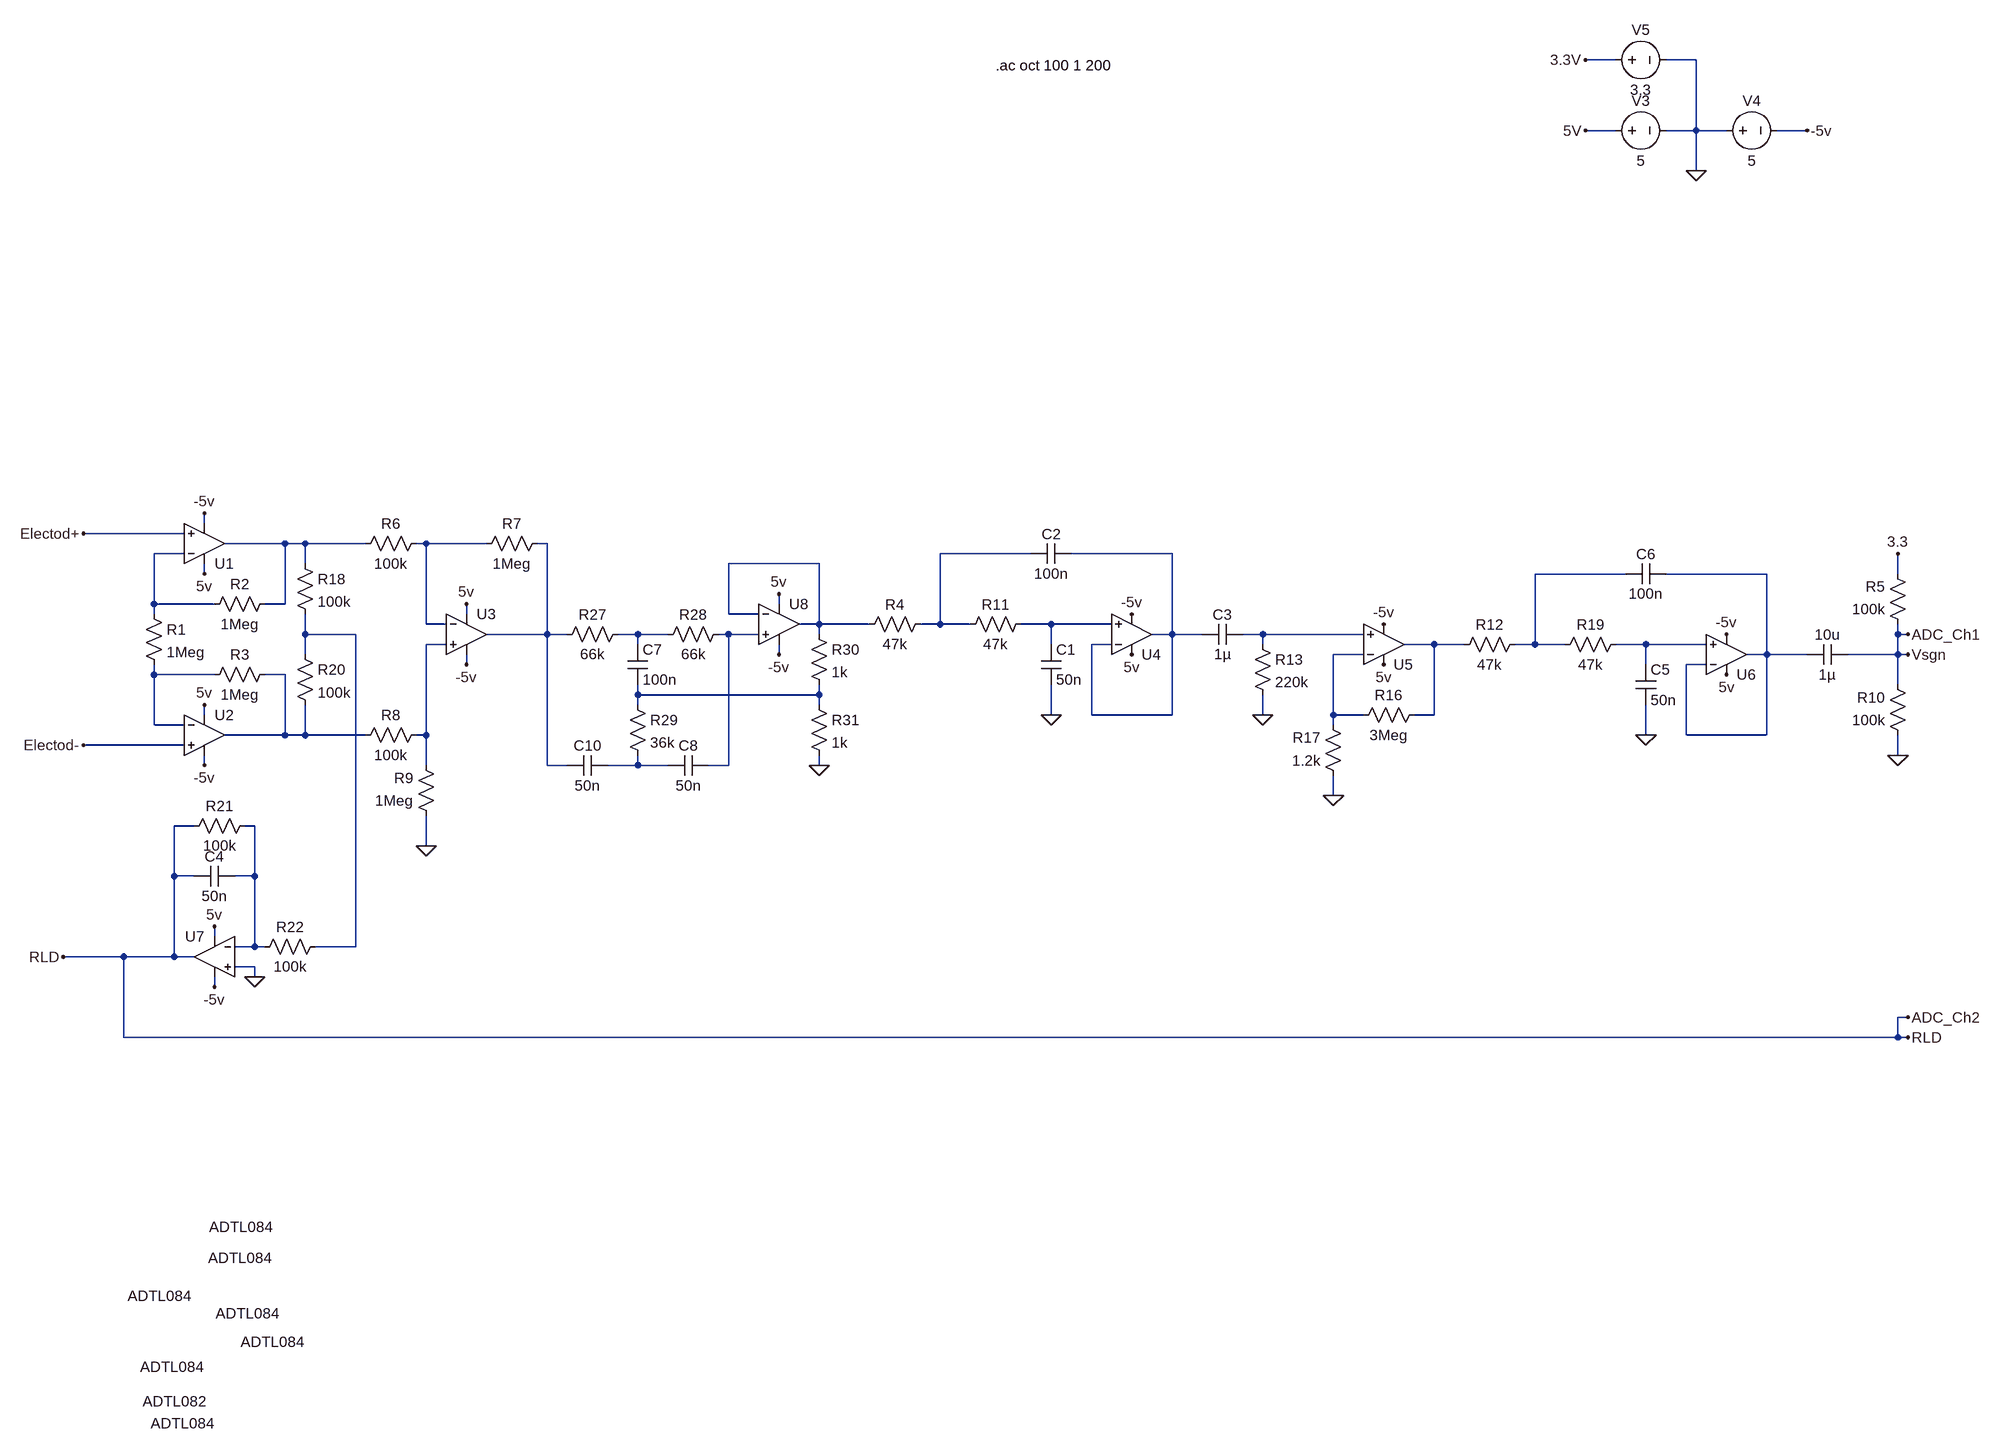
[diagram p0: schematic InstrumentationAmp.asc]
InstrumentationAmp.asc, the LTspice schematic file:
Version 4.1
SHEET 1 2556 1432
WIRE 1952 -752 1904 -752
WIRE 2080 -752 2032 -752
WIRE 1952 -640 1904 -640
WIRE 2080 -640 2080 -752
WIRE 2080 -640 2032 -640
WIRE 2128 -640 2080 -640
WIRE 2256 -640 2208 -640
WIRE 2080 -576 2080 -640
WIRE -288 -16 -288 -32
WIRE -320 0 -480 0
WIRE -160 16 -256 16
WIRE -128 16 -160 16
WIRE -32 16 -128 16
WIRE 64 16 48 16
WIRE 160 16 64 16
WIRE 256 16 240 16
WIRE -320 32 -368 32
WIRE 1024 32 880 32
WIRE 1248 32 1088 32
WIRE -128 48 -128 16
WIRE 688 48 544 48
WIRE -288 64 -288 48
WIRE 1968 64 1824 64
WIRE 2192 64 2032 64
WIRE 2400 64 2400 32
WIRE -368 112 -368 32
WIRE -272 112 -368 112
WIRE -160 112 -160 16
WIRE -160 112 -192 112
WIRE 624 112 624 96
WIRE -368 128 -368 112
WIRE 128 128 128 112
WIRE 544 128 544 48
WIRE 592 128 544 128
WIRE 64 144 64 16
WIRE 96 144 64 144
WIRE 688 144 688 48
WIRE 688 144 656 144
WIRE 768 144 688 144
WIRE 880 144 880 32
WIRE 880 144 848 144
WIRE 928 144 880 144
WIRE 1056 144 1008 144
WIRE 1152 144 1056 144
WIRE -128 160 -128 128
WIRE -48 160 -128 160
WIRE 256 160 256 16
WIRE 256 160 160 160
WIRE 288 160 256 160
WIRE 400 160 368 160
WIRE 448 160 400 160
WIRE 544 160 528 160
WIRE 592 160 544 160
WIRE 688 160 688 144
WIRE 1248 160 1248 32
WIRE 1248 160 1216 160
WIRE 1296 160 1248 160
WIRE 1392 160 1360 160
WIRE 1552 160 1392 160
WIRE 2400 160 2400 144
WIRE 2416 160 2400 160
WIRE 96 176 64 176
WIRE 400 176 400 160
WIRE 1056 176 1056 144
WIRE 1152 176 1120 176
WIRE 1392 176 1392 160
WIRE 1664 176 1616 176
WIRE 1712 176 1664 176
WIRE 1824 176 1824 64
WIRE 1824 176 1792 176
WIRE 1872 176 1824 176
WIRE 2000 176 1952 176
WIRE 2096 176 2000 176
WIRE -128 192 -128 160
WIRE 624 192 624 176
WIRE 1552 192 1504 192
WIRE 2192 192 2192 64
WIRE 2192 192 2160 192
WIRE 2256 192 2192 192
WIRE 2400 192 2400 160
WIRE 2400 192 2320 192
WIRE 2416 192 2400 192
WIRE 128 208 128 192
WIRE 2000 208 2000 176
WIRE 2096 208 2064 208
WIRE -368 224 -368 208
WIRE -272 224 -368 224
WIRE -160 224 -192 224
WIRE 2400 240 2400 192
WIRE 400 256 400 240
WIRE 688 256 688 240
WIRE 688 256 400 256
WIRE 400 272 400 256
WIRE 688 272 688 256
WIRE -288 288 -288 272
WIRE 1056 288 1056 240
WIRE 1120 288 1120 176
WIRE 1248 288 1248 160
WIRE 1248 288 1120 288
WIRE 1392 288 1392 256
WIRE 1504 288 1504 192
WIRE 1552 288 1504 288
WIRE 1664 288 1664 176
WIRE 1664 288 1632 288
WIRE -368 304 -368 224
WIRE -320 304 -368 304
WIRE 1504 304 1504 288
WIRE -160 320 -160 224
WIRE -160 320 -256 320
WIRE -128 320 -128 272
WIRE -128 320 -160 320
WIRE -32 320 -128 320
WIRE 64 320 64 176
WIRE 64 320 48 320
WIRE 2000 320 2000 272
WIRE 2064 320 2064 208
WIRE 2192 320 2192 192
WIRE 2192 320 2064 320
WIRE -320 336 -480 336
WIRE 2400 352 2400 320
WIRE -288 368 -288 352
WIRE 64 368 64 320
WIRE 256 368 256 160
WIRE 288 368 256 368
WIRE 400 368 400 352
WIRE 400 368 352 368
WIRE 448 368 400 368
WIRE 544 368 544 160
WIRE 544 368 512 368
WIRE 688 368 688 352
WIRE 1504 416 1504 384
WIRE -304 464 -336 464
WIRE -208 464 -224 464
WIRE 64 496 64 448
WIRE -336 544 -336 464
WIRE -304 544 -336 544
WIRE -208 544 -208 464
WIRE -208 544 -240 544
WIRE -272 640 -272 624
WIRE -208 656 -208 544
WIRE -208 656 -240 656
WIRE -192 656 -208 656
WIRE -48 656 -48 160
WIRE -48 656 -112 656
WIRE -416 672 -512 672
WIRE -336 672 -336 544
WIRE -336 672 -416 672
WIRE -304 672 -336 672
WIRE -208 688 -240 688
WIRE -208 704 -208 688
WIRE -272 720 -272 704
WIRE 2416 768 2400 768
WIRE -416 800 -416 672
WIRE 2400 800 2400 768
WIRE 2400 800 -416 800
WIRE 2416 800 2400 800
FLAG 2080 -576 0
FLAG 1904 -640 5V
FLAG 2256 -640 -5v
FLAG -288 64 5v
FLAG -288 -32 -5v
FLAG -288 272 5v
FLAG -288 368 -5v
FLAG 128 112 5v
FLAG 128 208 -5v
FLAG 64 496 0
FLAG 2400 352 0
FLAG 2400 32 3.3
FLAG 2416 192 Vsgn
FLAG 1904 -752 3.3V
FLAG 1184 128 -5v
FLAG 1184 192 5v
FLAG 1056 288 0
FLAG 1392 288 0
FLAG 1584 208 5v
FLAG 1584 144 -5v
FLAG 1504 416 0
FLAG 2128 160 -5v
FLAG 2128 224 5v
FLAG 2000 320 0
FLAG -272 624 5v
FLAG -272 720 -5v
FLAG -208 704 0
FLAG 624 96 5v
FLAG 624 192 -5v
FLAG 688 368 0
FLAG -480 0 Electod+
FLAG -480 336 Electod-
FLAG -512 672 RLD
FLAG 2416 800 RLD
FLAG 2416 160 ADC_Ch1
FLAG 2416 768 ADC_Ch2
SYMBOL OpAmps\\ADTL084 -288 80 M180
WINDOW 3 8 -1021 Left 2
SYMATTR InstName U1
SYMBOL voltage 1936 -640 R270
WINDOW 0 32 56 VTop 2
WINDOW 3 -32 56 VBottom 2
WINDOW 123 0 0 Left 0
WINDOW 39 0 0 Left 0
SYMATTR InstName V3
SYMATTR Value 5
SYMBOL voltage 2112 -640 R270
WINDOW 0 32 56 VTop 2
WINDOW 3 -32 56 VBottom 2
WINDOW 123 0 0 Left 0
WINDOW 39 0 0 Left 0
SYMATTR InstName V4
SYMATTR Value 5
SYMBOL res -384 112 R0
SYMATTR InstName R1
SYMATTR Value 1Meg
SYMBOL res -288 128 R270
WINDOW 0 32 56 VTop 2
WINDOW 3 0 56 VBottom 2
SYMATTR InstName R2
SYMATTR Value 1Meg
SYMBOL res -288 240 R270
WINDOW 0 32 56 VTop 2
WINDOW 3 0 56 VBottom 2
SYMATTR InstName R3
SYMATTR Value 1Meg
SYMBOL OpAmps\\ADTL084 -288 256 R0
WINDOW 3 6 894 Left 2
SYMATTR InstName U2
SYMBOL OpAmps\\ADTL084 128 96 R0
WINDOW 3 -358 1187 Left 2
SYMATTR InstName U3
SYMBOL res 64 0 R90
WINDOW 0 0 56 VBottom 2
WINDOW 3 32 56 VTop 2
SYMATTR InstName R6
SYMATTR Value 100k
SYMBOL res 256 0 R90
WINDOW 0 0 56 VBottom 2
WINDOW 3 32 56 VTop 2
SYMATTR InstName R7
SYMATTR Value 1Meg
SYMBOL res 64 304 R90
WINDOW 0 0 56 VBottom 2
WINDOW 3 32 56 VTop 2
SYMATTR InstName R8
SYMATTR Value 100k
SYMBOL res 80 464 R180
WINDOW 0 36 76 Left 2
WINDOW 3 36 40 Left 2
SYMATTR InstName R9
SYMATTR Value 1Meg
SYMBOL res 2416 160 R180
WINDOW 0 36 76 Left 2
WINDOW 3 36 40 Left 2
SYMATTR InstName R5
SYMATTR Value 100k
SYMBOL res 2416 336 R180
WINDOW 0 36 76 Left 2
WINDOW 3 36 40 Left 2
SYMATTR InstName R10
SYMATTR Value 100k
SYMBOL voltage 1936 -752 R270
WINDOW 0 32 56 VTop 2
WINDOW 3 -32 56 VBottom 2
WINDOW 123 0 0 Left 0
WINDOW 39 0 0 Left 0
SYMATTR InstName V5
SYMATTR Value 3.3
SYMBOL OpAmps\\ADTL084 1184 224 M180
WINDOW 3 -1574 -1099 Left 2
SYMATTR InstName U4
SYMBOL cap 2320 176 R90
WINDOW 0 0 32 VBottom 2
WINDOW 3 32 32 VTop 2
SYMATTR InstName 10u
SYMATTR Value 1µ
SYMBOL res 864 128 R90
WINDOW 0 0 56 VBottom 2
WINDOW 3 32 56 VTop 2
SYMATTR InstName R4
SYMATTR Value 47k
SYMBOL cap 1360 144 R90
WINDOW 0 0 32 VBottom 2
WINDOW 3 32 32 VTop 2
SYMATTR InstName C3
SYMATTR Value 1µ
SYMBOL res 1376 160 R0
SYMATTR InstName R13
SYMATTR Value 220k
SYMBOL OpAmps\\ADTL082 1584 240 M180
WINDOW 3 -1970 -1138 Left 2
SYMATTR InstName U5
SYMBOL res 1648 272 R90
WINDOW 0 0 56 VBottom 2
WINDOW 3 32 56 VTop 2
SYMATTR InstName R16
SYMATTR Value 3Meg
SYMBOL res 1520 400 R180
WINDOW 0 36 76 Left 2
WINDOW 3 36 40 Left 2
SYMATTR InstName R17
SYMATTR Value 1.2k
SYMBOL res 1024 128 R90
WINDOW 0 0 56 VBottom 2
WINDOW 3 32 56 VTop 2
SYMATTR InstName R11
SYMATTR Value 47k
SYMBOL cap 1040 176 R0
SYMATTR InstName C1
SYMATTR Value 50n
SYMBOL cap 1088 16 R90
WINDOW 0 0 32 VBottom 2
WINDOW 3 32 32 VTop 2
SYMATTR InstName C2
SYMATTR Value 100n
SYMBOL OpAmps\\ADTL084 2128 256 M180
WINDOW 3 -2501 -1157 Left 2
SYMATTR InstName U6
SYMBOL res 1808 160 R90
WINDOW 0 0 56 VBottom 2
WINDOW 3 32 56 VTop 2
SYMATTR InstName R12
SYMATTR Value 47k
SYMBOL res 1968 160 R90
WINDOW 0 0 56 VBottom 2
WINDOW 3 32 56 VTop 2
SYMATTR InstName R19
SYMATTR Value 47k
SYMBOL cap 1984 208 R0
SYMATTR InstName C5
SYMATTR Value 50n
SYMBOL cap 2032 48 R90
WINDOW 0 0 32 VBottom 2
WINDOW 3 32 32 VTop 2
SYMATTR InstName C6
SYMATTR Value 100n
SYMBOL res -144 32 R0
SYMATTR InstName R18
SYMATTR Value 100k
SYMBOL res -144 176 R0
SYMATTR InstName R20
SYMATTR Value 100k
SYMBOL OpAmps\\ADTL084 -272 608 M0
WINDOW 3 -104 630 Left 2
SYMATTR InstName U7
SYMBOL res -208 448 R90
WINDOW 0 0 56 VBottom 2
WINDOW 3 32 56 VTop 2
SYMATTR InstName R21
SYMATTR Value 100k
SYMBOL res -96 640 R90
WINDOW 0 0 56 VBottom 2
WINDOW 3 32 56 VTop 2
SYMATTR InstName R22
SYMATTR Value 100k
SYMBOL cap -240 528 R90
WINDOW 0 0 32 VBottom 2
WINDOW 3 32 32 VTop 2
SYMATTR InstName C4
SYMATTR Value 50n
SYMBOL OpAmps\\ADTL084 624 80 R0
WINDOW 3 -1034 1130 Left 2
SYMATTR InstName U8
SYMBOL res 384 144 R90
WINDOW 0 0 56 VBottom 2
WINDOW 3 32 56 VTop 2
SYMATTR InstName R27
SYMATTR Value 66k
SYMBOL res 544 144 R90
WINDOW 0 0 56 VBottom 2
WINDOW 3 32 56 VTop 2
SYMATTR InstName R28
SYMATTR Value 66k
SYMBOL cap 384 176 R0
SYMATTR InstName C7
SYMATTR Value 100n
SYMBOL res 384 256 R0
SYMATTR InstName R29
SYMATTR Value 36k
SYMBOL cap 512 352 R90
WINDOW 0 0 32 VBottom 2
WINDOW 3 32 32 VTop 2
SYMATTR InstName C8
SYMATTR Value 50n
SYMBOL cap 352 352 R90
WINDOW 0 0 32 VBottom 2
WINDOW 3 32 32 VTop 2
SYMATTR InstName C10
SYMATTR Value 50n
SYMBOL res 672 144 R0
SYMATTR InstName R30
SYMATTR Value 1k
SYMBOL res 672 256 R0
SYMATTR InstName R31
SYMATTR Value 1k
TEXT 968 -744 Left 2 !.ac oct 100 1 200

The netlist it stands for:
* InstrumentationAmp.asc
X§U1 Electod+ N004 5V -5v N001 ADTL084  ; pins In+ In- V+ V- OUT
V3 5V 0 5
V4 0 -5v 5
R1 N004 N019 1Meg
R2 N004 N001 1Meg
R3 N019 N020 1Meg
X§U2 Electod- N019 5V -5v N020 ADTL084  ; pins In+ In- V+ V- OUT
X§U3 N015 N002 5V -5v N003 ADTL084  ; pins In+ In- V+ V- OUT
R6 N002 N001 100k
R7 N003 N002 1Meg
R8 N015 N020 100k
R9 0 N015 1Meg
R5 ADC_Ch1 3.3 100k
R10 0 ADC_Ch1 100k
V5 3.3V 0 3.3
X§U4 N010 N006 5V -5v N006 ADTL084  ; pins In+ In- V+ V- OUT
C§10u ADC_Ch1 N009 1µ
R4 N005 N007 47k
C3 N014 N006 1µ
R13 N014 0 220k
X§U5 N014 N018 5V -5v N016 ADTL082  ; pins In+ In- V+ V- OUT
R16 N016 N018 3Meg
R17 0 N018 1.2k
R11 N010 N005 47k
C1 N010 0 50n
C2 N006 N005 100n
X§U6 N017 N009 5V -5v N009 ADTL084  ; pins In+ In- V+ V- OUT
R12 N008 N016 47k
R19 N017 N008 47k
C5 N017 0 50n
C6 N009 N008 100n
R18 N001 N011 100k
R20 N011 N020 100k
X§U7 0 N023 5V -5v ADC_Ch2 ADTL084  ; pins In+ In- V+ V- OUT
R21 N023 ADC_Ch2 100k
R22 N011 N023 100k
C4 N023 ADC_Ch2 50n
X§U8 N013 N007 5V -5v N007 ADTL084  ; pins In+ In- V+ V- OUT
R27 N012 N003 66k
R28 N013 N012 66k
C7 N012 N021 100n
R29 N021 N022 36k
C8 N013 N022 50n
C10 N022 N003 50n
R30 N007 N021 1k
R31 N021 0 1k
.ac oct 100 1 200
.lib ADTL084.lib
.lib ADI.lib
.backanno
.end